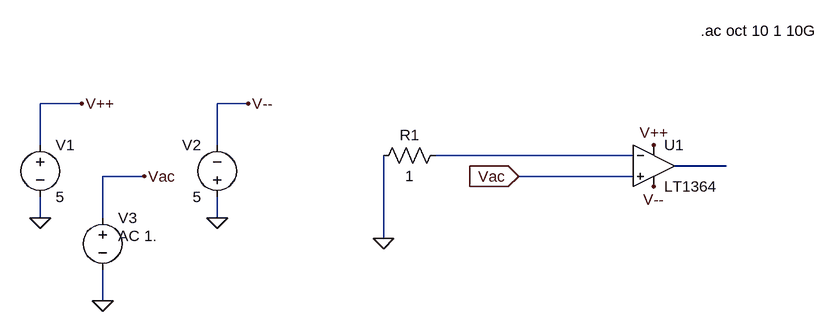
[diagram p0: schematic Prueba_LT1364.asc]
Prueba_LT1364.asc, the LTspice schematic file:
Version 4
SHEET 1 1012 680
WIRE -176 -16 -240 -16
WIRE 80 -16 32 -16
WIRE -240 48 -240 -16
WIRE 32 48 32 -16
WIRE 672 64 368 64
WIRE 816 80 736 80
WIRE -80 96 -144 96
WIRE 672 96 496 96
WIRE -240 160 -240 128
WIRE -144 160 -144 96
WIRE 32 160 32 128
WIRE 288 192 288 64
WIRE -144 288 -144 240
FLAG 704 112 V--
FLAG 704 48 V++
FLAG -240 160 0
FLAG 32 160 0
FLAG -176 -16 V++
FLAG 80 -16 V--
FLAG -144 288 0
FLAG -80 96 Vac
FLAG 496 96 Vac
IOPIN 496 96 In
FLAG 288 192 0
SYMBOL Opamps\\LT1364 704 16 R0
SYMATTR InstName U1
SYMBOL voltage -240 32 R0
WINDOW 123 0 0 Left 0
WINDOW 39 0 0 Left 0
SYMATTR InstName V1
SYMATTR Value 5
SYMBOL voltage 32 144 R180
WINDOW 0 24 96 Left 2
WINDOW 3 24 16 Left 2
SYMATTR InstName V2
SYMATTR Value 5
SYMBOL voltage -144 144 R0
WINDOW 123 24 44 Left 2
WINDOW 39 0 0 Left 0
SYMATTR Value2 AC 1.
SYMATTR InstName V3
SYMATTR Value ""
SYMBOL res 384 48 R90
WINDOW 0 0 56 VBottom 2
WINDOW 3 32 56 VTop 2
SYMATTR InstName R1
SYMATTR Value 1
TEXT 776 -128 Left 2 !.ac oct 10 1 10G

The netlist it stands for:
* Prueba_LT1364.asc
XU1 Vac N001 V++ V-- N002 LT1363  ; LT1364, pins In+ In- V+ V- OUT
V1 V++ 0 5
V2 0 V-- 5
V3 Vac 0 AC 1.
R1 N001 0 1
.ac oct 10 1 10G
.lib LTC.lib
.backanno
.end